# Altium project SUBBOARD-current_measurement.PrjPcb
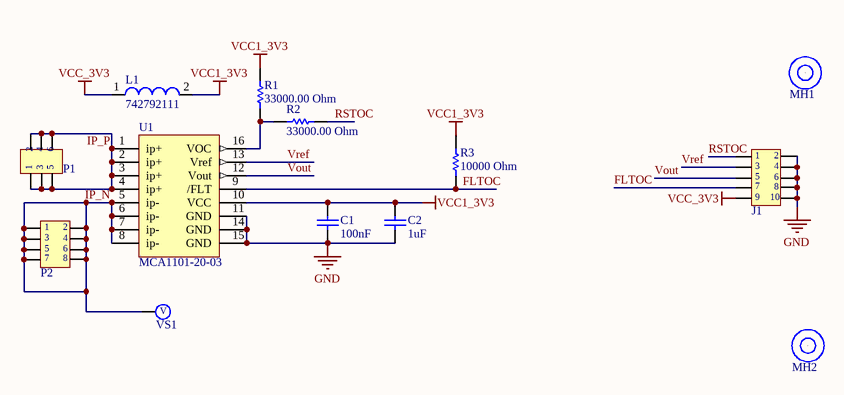
[diagram p0: SUBBOARD-current_measurement.SchDoc]
1 sheet, 13 parts. Net scope: global (net labels, ports and power ports of the same name join across sheets).
Board file: SUBBOARD-current_measurement.PcbDoc

## Sheet SUBBOARD-current_measurement.SchDoc
size A4

### Parts
C1  value 100nF  [CAPC0603(1608)100_L]  (hidden comment: CAP 100nF 10V 0603(1608))
C2  value 1uF  [CAPC0603(1608)100_L]  (hidden comment: CAP 1uF 50V 0603(1608))
J1  0878311020  [0878311020]  (value not drawn)
L1  742792111  [SMD-1206]
MH1  9774020633R  [9774020633R]  (value not drawn)
MH2  9774020633R  [9774020633R]  (value not drawn)
P1  TSW-103-15-G-D  [TSW-103-15-G-D]  (value not drawn)
P2  TSW-104-15-G-D  [TSW-104-15-G-D]  (value not drawn)
R1  value 33000.00 Ohm  [RESC0805(2012)_N]  (hidden comment: 33K 5% 0805(2012))
R2  value 33000.00 Ohm  [RESC0805(2012)_M]  (hidden comment: 33K 5% 0805(2012))
R3  value 10000 Ohm  [RESC1609X50X30NL8T20]  (hidden comment: CRCW060310K0FKEA)
U1  MCA1101-20-03  [SOIC127P1030X265-16N]
VS1  Voltage_Probe  [Voltage Probe]  (value not drawn)

### Nets
GND: C1.1 C2.1 J1.2 J1.4 J1.6 J1.8 J1.10 U1.11(GND) U1.14(GND) U1.15(GND)
VCC1_3V3: C1.2 C2.2 L1.2 R1.2 R3.1 U1.10(VCC)
VCC_3V3: J1.9 L1.1
FLTOC: J1.7 R3.2 U1.9(/FLT)
IP_N: P2.1 P2.2 P2.3 P2.4 P2.5 P2.6 P2.7 P2.8 U1.5(ip-) U1.6(ip-) U1.7(ip-) U1.8(ip-) VS1.1
IP_P: P1.1 P1.2 P1.3 P1.4 P1.5 P1.6 U1.1(ip+) U1.2(ip+) U1.3(ip+) U1.4(ip+)
RSTOC: J1.1 R2.1
Vout: J1.5 U1.12(Vout)
Vref: J1.3 U1.13(Vref)
NetR1_1: R1.1 R2.2 U1.16(VOC)

Not connected (* = marked no-connect by the designer): MH1 1; MH2 1

### Notes on the sheet
- (in symbol Voltage_Probe) V

### Library data of the parts
C1 = CMP-1035-02580-1: CAP 100nF 10V ±10% 0603 (1608 Metric) Thickness 1mm SMD; Tolerance: Â±10%; Case-EIA: 0603; Case-Metric: 1608; Max Thickness: 1 mm; Rated Voltage: 10 V; Technology: SMT
C2 = CMP-1035-02746-1: CAP 1uF 50V ±20% 0603 (1608 Metric) Thickness 1mm SMD; Tolerance: Â±20%; Case-EIA: 0603; Case-Metric: 1608; Technology: SMT; Max Thickness: 1 mm; Rated Voltage: 50 V
J1 = 0878311020: Conn Shrouded Header HDR 10 POS 2mm Solder ST Thru-Hole Milli-Grid™ Tube; Manufacturer: Molex; Number of Positions: 10; Connector Type: Male Pin; Row Spacing: 0.079inch; Supplier 1: Digi-Key; Manufacturer Part Number: 0878311020; RoHS: Yes; Category: Headers and Wire Housings; Stock 1: 7937; Pricing 1: 1=1.65000, 10=1.50100, 100=1.28650, 500=1.07206, 1000=0.91890, 5000=0.81476, 10000=0.79638 (USD); Mount: Through Hole; Contact Plating: Gold; Contact Material: Bronze; Color: Black; Housing Material: Nylon; Housing Color: Black; Min Operating Temperature: -55°C; Max Operating Temperature: 105°C; Termination: Solder; Number of Contacts: 10; Number of Rows: 2; Packaging: Rail/Tube; Orientation: Straight; Length: 12.65mm; Pitch: 2mm; Contact Mating Length: 0.141inch; Depth: 6.3mm; Radiation Hardening: No; ComponentLink1URL: https://datasheet.ciiva.com/6814/878311620-sd-6814006.pdf?src-supplier=Digi-Key; ComponentLink1Description: https://datasheet.ciiva.com/6814/878311620-sd-6814006.pdf?src-supplier=Digi-Key; Supplier Part Number 1: WM18560-ND
L1 = CMP-0220-00024-1: SMD EMI Suppression Ferrite Bead WE-CBF, Z = 26 Ohm; Impedance: 26 Ohm; ComponentLink2Description: Datasheet; PackageReference: SMD-1206; ComponentLink2URL: http://www.we-online.de/katalog/media/pdf/742792111.pdf; PackageVersion: 2007; DatasheetVersion: Dec-2005; PackageDescription: Chip Inductor, 2-Leads, Body 3.2 x 1.6 mm; ComponentLink1URL: http://www.we-online.com; ComponentLink1Description: Manufacturer Link
MH1 MH2 = 9774020633R: Manufacturer: Wurth Electronics; Supplier 1: Digi-Key; Manufacturer Part Number: 9774020633R; RoHS: No; Category: Spacers, Standoffs; Stock 1: 4105; Pricing 1: 1=0.96000, 10=0.87700, 50=0.78160, 100=0.68590, 500=0.63800, 1000=0.59015 (USD); Supplier Part Number 1: 732-13689-1-ND
P1 = TSW-103-15-G-D: .025" SQ. TERMINAL STRIPS; Manufacturer: Samtec; Number of Contacts: 6; Gender: Male; Max Voltage Rating (AC): 550V; Max Current Rating: 7.6A; Pitch: 2.54mm; Supplier 1: Digi-Key; Manufacturer Part Number: TSW-103-15-G-D; RoHS: Yes; Category: Headers and Wire Housings; Stock 1: 480; Pricing 1: 1=0.78000, 10=0.73200, 100=0.56120, 500=0.48800, 1000=0.40260, 5000=0.35380, 10000=0.32940 (USD); Contact Plating: Gold; Contact Material: Bronze; Housing Material: Polyester; Housing Color: Black; Min Operating Temperature: -55°C; Max Operating Temperature: 125°C; Termination: Solder; Number of Rows: 2; Packaging: Bulk; Orientation: Straight; Length: 7.62mm; Row Spacing: 2.54mm; Depth: 5.08mm; Radiation Hardening: No; REACH SVHC: No SVHC; ComponentLink1URL: https://datasheet.ciiva.com/16723/htsw-th-16723063.pdf?src-supplier=Avnet+Europe; ComponentLink1Description: https://datasheet.ciiva.com/16723/htsw-th-16723063.pdf?src-supplier=Avnet+Europe; ComponentLink2URL: https://datasheet.ciiva.com/29947/htsw-th-29947802.pdf?src-supplier=Avnet; ComponentLink2Description: https://datasheet.ciiva.com/29947/htsw-th-29947802.pdf?src-supplier=Avnet; Supplier Part Number 1: SAM12306-ND; Supplier 2: Mouser; Stock 2: 570; Pricing 2: 1=0.78000, 10=0.58500, 100=0.51200, 500=0.48800, 1000=0.40200, 2500=0.35300 (USD); Supplier 3: Avnet; Pricing 3: 1=0.76330, 10=0.71550, 30=0.71464, 50=0.71372, 100=0.54645 (USD); Supplier Part Number 2: 200-TSW10315GD; Supplier Part Number 3: TSW-103-15-G-D
P2 = TSW-104-15-G-D: SAMTEC         TSW-104-15-G-D             Board-To-Board Connector, Vertical, TSW Series, 8 Contacts, Header, 2.54 mm, Through Hole, 2 Rows; Number of Contacts: 8; Gender: Male; Max Voltage Rating (AC): 550V; Max Current Rating: 7.6A; Pitch: 2.54mm; Supplier 1: Digi-Key; Manufacturer: Samtec; Manufacturer Part Number: TSW-104-15-G-D; RoHS: Yes; Category: Connectors; Stock 1: 33; Pricing 1: 1=0.94000, 10=0.82900, 100=0.71500, 500=0.58500, 1000=0.52000, 5000=0.45500, 10000=0.43225 (USD); Contact Plating: Gold; Contact Material: Bronze; Housing Color: Black; Housing Material: Polyester; Min Operating Temperature: -55°C; Max Operating Temperature: 125°C; Number of Rows: 2; Termination: Solder; Packaging: Bulk; Orientation: Straight; Length: 10.16mm; Depth: 5.08mm; Radiation Hardening: No; REACH SVHC: No SVHC; ComponentLink1URL: http://www.farnell.com/datasheets/1992055.pdf?src-supplier=Farnell; ComponentLink1Description: http://www.farnell.com/datasheets/1992055.pdf?src-supplier=Farnell; ComponentLink2URL: http://components.arrow.com/part/dataview/0323_01320648?src-supplier=Arrow+Europe; ComponentLink2Description: http://components.arrow.com/part/dataview/0323_01320648?src-supplier=Arrow+Europe; ComponentLink3URL: http://components.arrow.com/part/dataview/2678257S8321538N1004?src-supplier=Arrow; ComponentLink3Description: http://components.arrow.com/part/dataview/2678257S8321538N1004?src-supplier=Arrow; ComponentLink4URL: http://www.samtec.com/ftppub/pdf/htsw_th.pdf?src-supplier=Avnet; ComponentLink4Description: http://www.samtec.com/ftppub/pdf/htsw_th.pdf?src-supplier=Avnet; ComponentLink5URL: http://www.samtec.com/ftppub/pdf/htsw_th.pdf?src-supplier=Avnet+Europe; ComponentLink5Description: http://www.samtec.com/ftppub/pdf/htsw_th.pdf?src-supplier=Avnet+Europe; ComponentLink6URL: http://suddendocs.samtec.com/prints/tsw-xxx-xx-x-x-xx-xxx-footprint.pdf?src-supplier=Digi-Key; ComponentLink6Description: http://suddendocs.samtec.com/prints/tsw-xxx-xx-x-x-xx-xxx-footprint.pdf?src-supplier=Digi-Key; Supplier Part Number 1: SAM12313-ND
R1 R2 = CMP-1013-00110-1: 33K 0.125W 5% 0805 (2012 Metric)  SMD; Case-EIA: 0805; Case-Metric: 2012; Power: 0.125 W; Tolerance: 5 %; Technology: SMT
R3 = CMP-1666-00005-4: Chip Resistor, 10 KOhm, +/- 1%, 100 mW, -55 to 155 degC, 0603 (1608 Metric), RoHS, Tape and Reel; Manufacturer: Vishay Semiconductor; Voltage Rating: 75 V; Max Operating Temperature: 155 degC; PackageDescription: 2-Pin Surface Mount Device, Body 1.575 x 0.85 mm; ComponentLink1Description: Manufacturer URL; RoHSCompliant: true; PackageReference: 0603; REACH SVHC: Unknown; Length: 1.55 mm; DatasheetVersion: 06/2012; Packaging: Tape and Reel; Min Operating Temperature: -55 degC; Mounting Technology: Surface Mount; ComponentLink2URL: https://datasheet.ciiva.com/11809/0900766b80d98afc-11809037.pdf; Height: 0.45 mm; ComponentLink2Description: Datasheet; Package Quantity: 5000; ComponentLink1URL: http://www.vishay.com/
U1 = MCA1101-20-03: High Accuracy Current Sensor IC with 1.5MHz 3dB Bandwidth and Isolation ±20A,, 3.3V, Ratiometric; Manufacturer: ACEINNA; Mouser Part Number: 438-MCA1101-20-3; Mouser Price/Stock: https://www.mouser.com/Search/Refine.aspx?Keyword=438-MCA1101-20-3; Datasheet Link: https://www.mouser.cl/datasheet/2/940/6020-1104-01_B_Datasheet_2c_Current_Sensor_Fix_Gai-1622847.pdf; Current rating: 20A; Supply voltage: 3.3V; Package/Case: SOIC 16